# EAGLE schematic project (EAGLE 9.7.0)
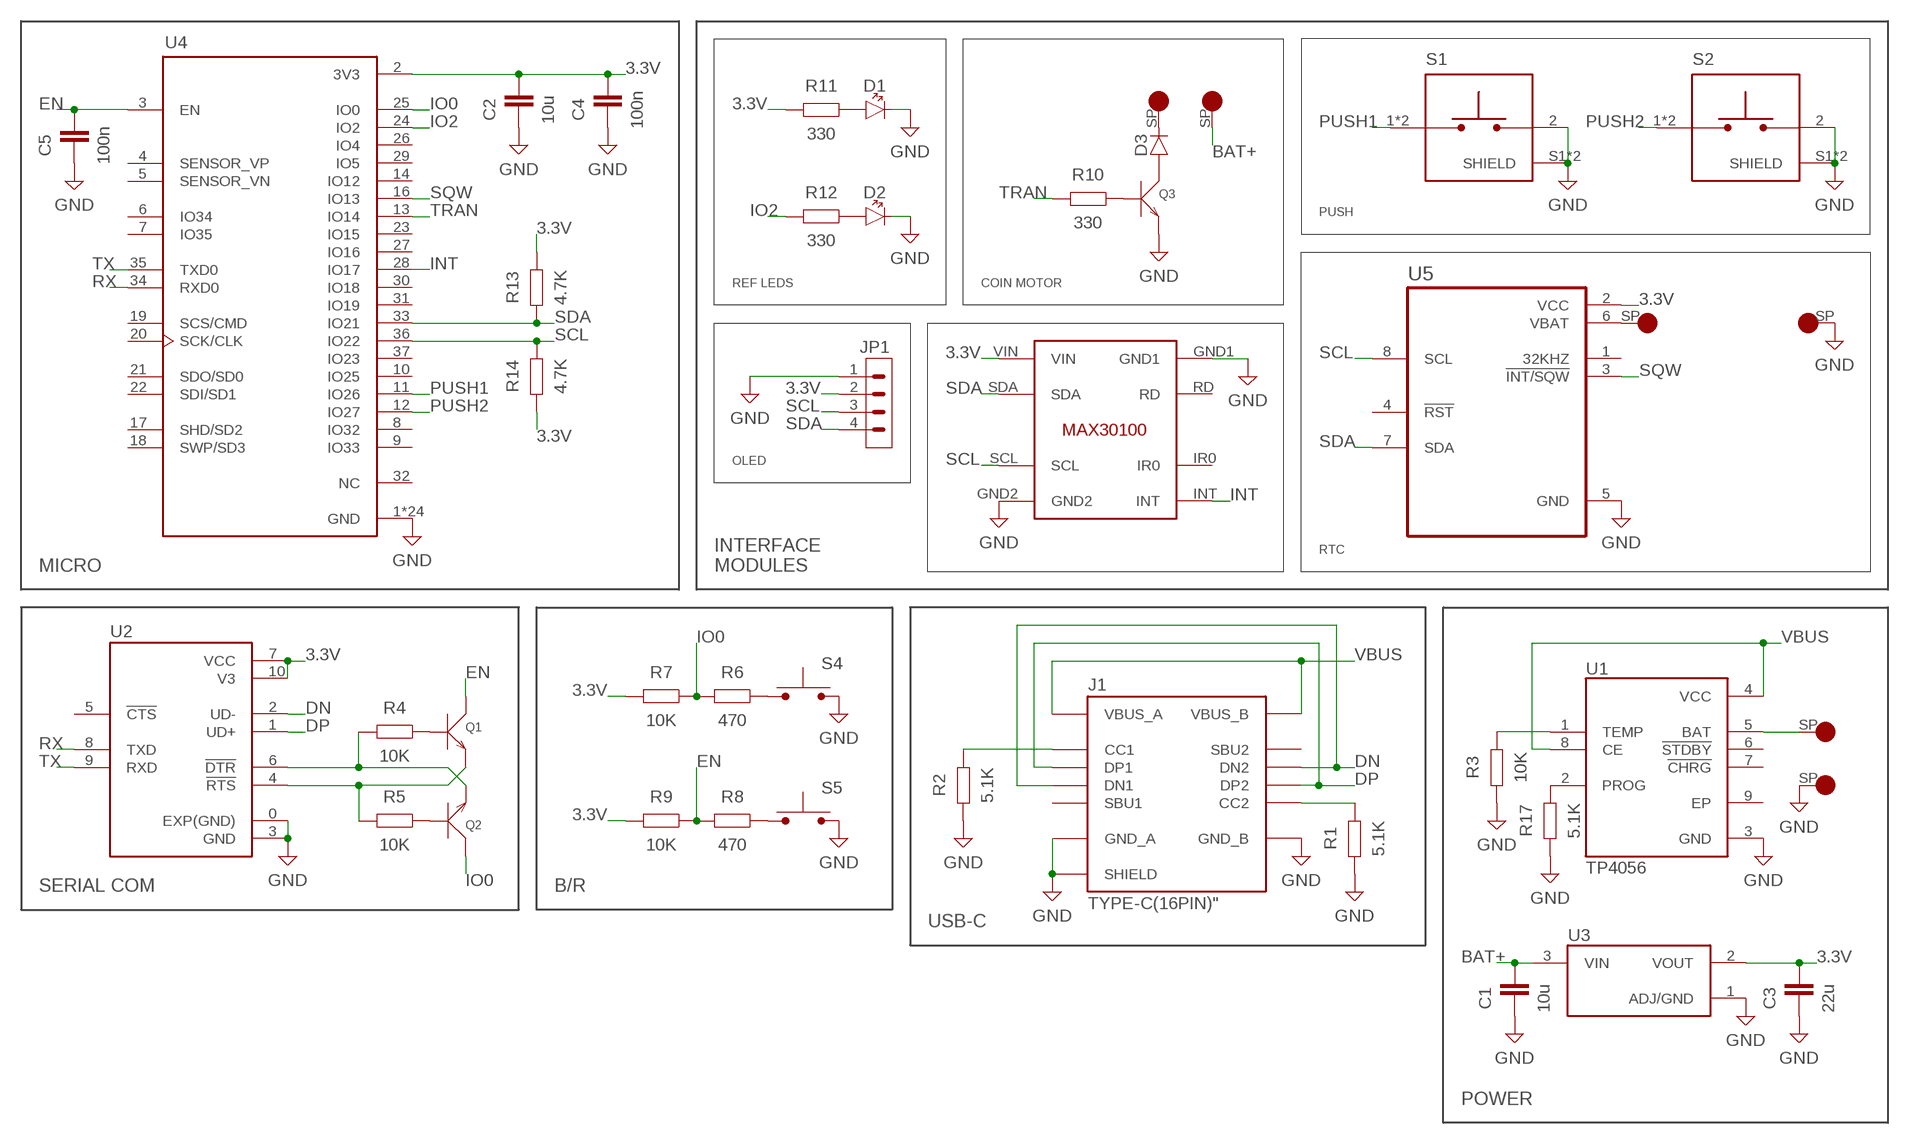
[diagram p0: schematic, sheet 1]

## Parts
BAT+  SOLDER_PAD_2MM  [SOLDER_PAD_2MM]
BAT-  SOLDER_PAD_2MM  [SOLDER_PAD_2MM]
C1  10u  C_CHIP-0805(2012-METRIC)  [CAPC2012X110]
C2  10u  C_CHIP-0805(2012-METRIC)  [CAPC2012X110]
C3  22u  C_CHIP-0805(2012-METRIC)  [CAPC2012X110]
C4  100n  C_CHIP-0805(2012-METRIC)  [CAPC2012X110]
C5  100n  C_CHIP-0805(2012-METRIC)  [CAPC2012X110]
CBAT+  SOLDER_PAD_2MM  [SOLDER_PAD_2MM]
CBAT-  SOLDER_PAD_2MM  [SOLDER_PAD_2MM]
D1  CHIP-FLAT-G_0805  [LEDC2012X110N_FLAT-G]
D2  CHIP-FLAT-R_0805  [LEDC2012X110N_FLAT-R]
D3  DIODE_1N4148W-7-F_SOD123G  [SOD3715X135]
J1  TYPE-C(16PIN)"  [TYPE-C(16PIN)]
JP1  PINHD-1X4  [1X04]
MTR+  SOLDER_PAD_2MM  [SOLDER_PAD_2MM]
MTR-  SOLDER_PAD_2MM  [SOLDER_PAD_2MM]
Q1  SMD-TRANSISTORS-NPN-25V-500MW(SOT-23)  [SOT-23]
Q2  SMD-TRANSISTORS-NPN-25V-500MW(SOT-23)  [SOT-23]
Q3  SMD-TRANSISTORS-NPN-25V-500MW(SOT-23)  [SOT-23]
R1  5.1K  R_CHIP-0805(2012-METRIC)  [RESC2012X65]
R2  5.1K  R_CHIP-0805(2012-METRIC)  [RESC2012X65]
R3  10K  R_CHIP-0805(2012-METRIC)  [RESC2012X65]
R4  10K  R_CHIP-0805(2012-METRIC)  [RESC2012X65]
R5  10K  R_CHIP-0805(2012-METRIC)  [RESC2012X65]
R6  470  R_CHIP-0805(2012-METRIC)  [RESC2012X65]
R7  10K  R_CHIP-0805(2012-METRIC)  [RESC2012X65]
R8  470  R_CHIP-0805(2012-METRIC)  [RESC2012X65]
R9  10K  R_CHIP-0805(2012-METRIC)  [RESC2012X65]
R10  330  R_CHIP-0805(2012-METRIC)  [RESC2012X65]
R11  330  R_CHIP-0805(2012-METRIC)  [RESC2012X65]
R12  330  R_CHIP-0805(2012-METRIC)  [RESC2012X65]
R13  4.7K  R_CHIP-0805(2012-METRIC)  [RESC2012X65]
R14  4.7K  R_CHIP-0805(2012-METRIC)  [RESC2012X65]
R17  5.1K  R_CHIP-0805(2012-METRIC)  [RESC2012X65]
S1  PUSH-LATERAL  [PUSH-LATERAL]
S2  PUSH-LATERAL  [PUSH-LATERAL]
S4  PUSH-4X3  [PUSH-4X3]
S5  PUSH-4X3  [PUSH-4X3]
U1  TP4056  [SOP127P600X175-9N]
U2  CH340XSOP50P490X110-10N  [SOP50P490X110-10N]
U3  AMS1117_3.3  [AMS1117_3.3]
U4  ESP32  [MODULE_ESP32-WROOM-32]
U5  DS3231MZ+  [SOIC127P600X175-8N]
U6  MAX30100MAX30100  [MAX30100]

## Nets
3.3V: C2.1 C3.1 C4.1 JP1.2 R7.2 R9.2 R11.2 R13.1 R14.2 U2.7(VCC) U2.10(V3) U3.2(VOUT) U4.2(3V3) U5.2(VCC) U6.VIN
BAT+: BAT+.SP(SP$1) C1.1 MTR-.SP(SP$1) U1.5(BAT) U3.3(VIN)
DN: J1.A7(DN1) J1.B7(DN2) U2.2(UD-)
DP: J1.A6(DP1) J1.B6(DP2) U2.1(UD+)
EN: C5.1 Q1.3(C) R8.2 R9.1 U4.3(EN)
GND: BAT-.SP(SP$1) C1.2 C2.2 C3.2 C4.2 C5.2 CBAT-.SP(SP$1) D1.C D2.C J1.A1_B12(GND_A) J1.B1_A12(GND_B) J1.SH1(SHIELD) J1.SH2(SHIELD) J1.SH3(SHIELD) J1.SH4(SHIELD) JP1.1 Q3.2(E) R1.2 R2.2 R3.2 R17.2 S1.2 S1.S1(SHIELD) S1.S2(SHIELD) S2.2 S2.S1(SHIELD) S2.S2(SHIELD) S4.2 S5.2 U1.3(GND) U2.0(EXP(GND)) U2.3(GND) U3.1(ADJ/GND) U4.1(GND) U4.15(GND) U4.38(GND) U4.39_1(GND) U4.39_2(GND) U4.39_3(GND) U4.39_4(GND) U4.39_5(GND) U4.39_6(GND) U4.39_7(GND) U4.39_8(GND) U4.39_9(GND) U4.39_10(GND) U4.39_11(GND) U4.39_12(GND) U4.39_13(GND) U4.39_14(GND) U4.39_15(GND) U4.39_16(GND) U4.39_17(GND) U4.39_18(GND) U4.39_19(GND) U4.39_20(GND) U4.39_21(GND) U5.5(GND) U6.GND1 U6.GND2
INT: U4.28(IO17) U6.INT
IO0: Q2.3(C) R6.2 R7.1 U4.25(IO0)
IO2: R12.2 U4.24(IO2)
N$1: J1.A5(CC1) R2.1
N$2: J1.B5(CC2) R1.1
N$3: Q1.1(B) R4.1
N$4: R3.1 U1.1(TEMP)
N$5: Q2.1(B) R5.1
N$6: CBAT+.SP(SP$1) U5.6(VBAT)
N$7: D1.A R11.1
N$8: R6.1 S4.1
N$9: D3.2(A) Q3.3(C)
N$10: R8.1 S5.1
N$11: D2.A R12.1
N$13: Q3.1(B) R10.1
N$15: R17.1 U1.2(PROG)
N$16: D3.1(C) MTR+.SP(SP$1)
N$21: Q1.2(E) R5.2 U2.4(!RTS)
N$22: Q2.2(E) R4.2 U2.6(!DTR)
PUSH1: S1.1 S1.3 U4.11(IO26)
PUSH2: S2.1 S2.3 U4.12(IO27)
RX: U2.8(TXD) U4.34(RXD0)
SCL: JP1.3 R14.1 U4.36(IO22) U5.8(SCL) U6.SCL
SDA: JP1.4 R13.2 U4.33(IO21) U5.7(SDA) U6.SDA
SQW: U4.16(IO13) U5.3(!INT/SQW)
TRAN: R10.2 U4.13(IO14)
TX: U2.9(RXD) U4.35(TXD0)
VBUS: J1.A4_B9(VBUS_A) J1.B4_A9(VBUS_B) U1.4(VCC) U1.8(CE)
Unconnected: J1.A8(SBU1) J1.B8(SBU2) U1.6(!STDBY) U1.7(!CHRG) U1.9(EP) U2.5(!CTS) U4.4(SENSOR_VP) U4.5(SENSOR_VN) U4.6(IO34) U4.7(IO35) U4.8(IO32) U4.9(IO33) U4.10(IO25) U4.14(IO12) U4.17(SHD/SD2) U4.18(SWP/SD3) U4.19(SCS/CMD) U4.20(SCK/CLK) U4.21(SDO/SD0) U4.22(SDI/SD1) U4.23(IO15) U4.26(IO4) U4.27(IO16) U4.29(IO5) U4.30(IO18) U4.31(IO19) U4.32(NC) U4.37(IO23) U5.1(32KHZ) U5.4(!RST) U6.IR0 U6.RD

## Notes on the sheet
- PUSH
- REF LEDS | COIN MOTOR
- OLED
- RTC
- MICRO
- INTERFACE
  MODULES
- SERIAL COM | B/R
- USB-C
- POWER

## Library data of the parts
BAT+ BAT- CBAT+ CBAT- MTR+ MTR- = SOLDER PAD:SOLDER_PAD_2MM
C1-C5 = Tutorial - Fusion 360:C: Capacitor - Generic
D1 = LED:CHIP-FLAT-G: Green LED - Generic
D2 = LED:CHIP-FLAT-R: Red LED - Generic
D3 = Diode:DIODE_: Diode Rectifier - Popular Parts
J1 = TYPE-C_16PIN_2MD__073_:TYPE-C(16PIN): Check availability <https://pricing.snapeda.com/parts/TYPE-C%2016PIN%202MD%20%28073%29/Shouhan/view-part?ref=eda>
JP1 = Connector:PINHD-1X4: Pin Header
Q1-Q3 = S8050:SMD-TRANSISTORS-NPN-25V-500MW(SOT-23): Check availability <https://pricing.snapeda.com/parts/S8050/MDD/view-part?ref=eda>
R1-R14 R17 = Resistor:R: Resistor Fixed - Generic
S1 S2 = PUSH BUTTONS:PUSH-LATERAL: Check availability <https://pricing.snapeda.com/parts/SKRTLAE010/ALPS/view-part?ref=eda>
S4 S5 = PUSH BUTTONS:PUSH-4X3: Check availability <https://pricing.snapeda.com/parts/TL1015AF160QG/E-Switch/view-part?ref=eda>
U1 = TP4056:TP4056: Check availability <https://pricing.snapeda.com/parts/TP4056/NanJing%20Top%20Power%20ASIC%20Corp./view-part?ref=eda>
U2 = CH340:CH340X: Check availability <https://pricing.snapeda.com/parts/CH340K/WCH/view-part?ref=eda>
U3 = LDO:AMS1117_3.3: Check availability <https://pricing.snapeda.com/parts/AMS1117-3.3/UMW/view-part?ref=eda>
U4 = MICRO:ESP32: Check availability <https://pricing.snapeda.com/parts/ESP32-WROOM-32/Espressif%20Systems/view-part?ref=eda>
U5 = DS3231MZ:DS3231MZ+: Check availability <https://pricing.snapeda.com/parts/DS3231MZ%2B/Analog%20Devices/view-part?ref=eda>
U6 = MAX30100:MAX30100